# Altium schematic sheet Sensors.SchDoc
size A4
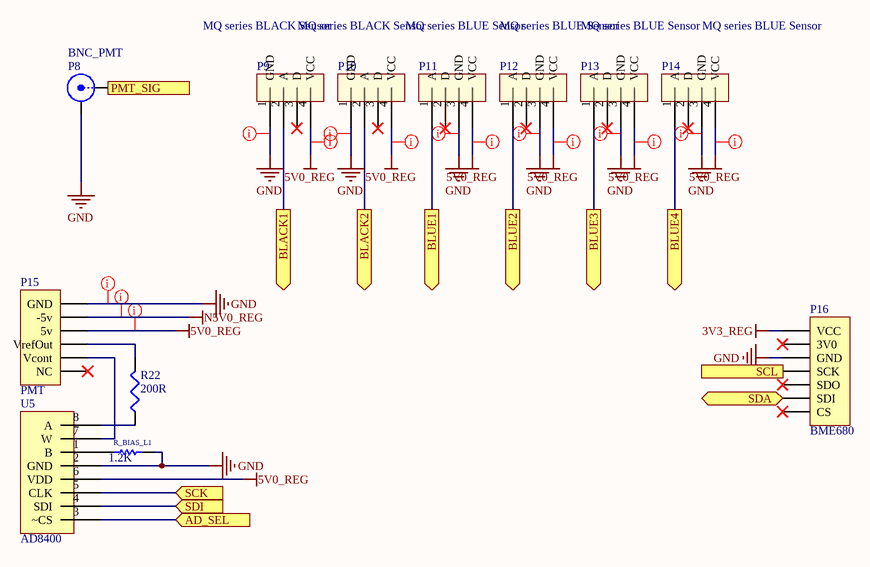
[diagram p0: Sensors.SchDoc]

## Parts
P8  BNC_PMT  [BNC_RA CON]
P9  MQ series BLACK Sensor  [MQ series BLACK sensor]
P10  MQ series BLACK Sensor  [MQ series BLACK sensor]
P11  MQ series BLUE Sensor  [MQ series BLUE sensor]
P12  MQ series BLUE Sensor  [MQ series BLUE sensor]
P13  MQ series BLUE Sensor  [MQ series BLUE sensor]
P14  MQ series BLUE Sensor  [MQ series BLUE sensor]
P15  PMT  [HDR1X6H]
P16  BME680  [HDR1X7]
R22  200R  [RESC1608X06N_0603]
R_BIAS_L1  1.2K  [RESC1608X06N_0603]
U5  AD8400  [AD8400(SOIC8)]

## Ports
AD_SEL (in), BLACK1 (out), BLACK2 (out), BLUE1 (out), BLUE2 (out), BLUE3 (out), BLUE4 (out), PMT_SIG (out), SCK (in), SCL (in), SDA (bidir), SDI (in)

## Nets
3V3_REG: P16.1(VCC)
5V0_REG: P9.4(VCC) P10.4(VCC) P11.4(VCC) P12.4(VCC) P13.4(VCC) P14.4(VCC) P15.6(5v) U5.6(VDD)
GND: P8.2(Y) P9.1(GND) P10.1(GND) P11.3(GND) P12.3(GND) P13.3(GND) P14.3(GND) P15.4(GND) P16.3(GND) R_BIAS_L1.2 U5.2(GND)
N5V0_REG: P15.5(-5v)
AD_SEL: U5.3(~CS) ; port AD_SEL
BLACK1: P9.2(A) ; port BLACK1
BLACK2: P10.2(A) ; port BLACK2
BLUE1: P11.1(A) ; port BLUE1
BLUE2: P12.1(A) ; port BLUE2
BLUE3: P13.1(A) ; port BLUE3
BLUE4: P14.1(A) ; port BLUE4
PMT_SIG: P8.1(X) ; port PMT_SIG
SCK: U5.5(CLK) ; port SCK
SCL: P16.4(SCK) ; port SCL
SDA: P16.6(SDI) ; port SDA
SDI: U5.4(SDI) ; port SDI
NetP15_2: P15.2(Vcont) U5.7(W)
NetP15_3: P15.3(VrefOut) R22.2
NetR22_1: R22.1 U5.8(A)
NetR_BIAS_L1_1: R_BIAS_L1.1 U5.1(B)

Not connected (* = marked no-connect by the designer): P9 3(D)*; P10 3(D)*; P11 2(D)*; P12 2(D)*; P13 2(D)*; P14 2(D)*; P15 1(NC)*; P16 2(3V0)* 5(SDO)* 7(CS)*

## Layout directives
rule Width Constraint [Pref Width = 15mil    Min Width = 15mil    Max Width = 15mil]: 5V0_REG, GND, N5V0_REG

## Library data of the parts
P8 = BNC: BNC Elbow Connector; LatestRevisionDate: 17-Jul-2002; LatestRevisionNote: Re-released for DXP Platform.; Publisher: Altium Limited
P15 = Header 6H: Header, 6-Pin, Right Angle; LatestRevisionDate: 17-Jul-2002; LatestRevisionNote: Re-released for DXP Platform.; Publisher: Altium Limited
P16 = Header 7: Header, 7-Pin; LatestRevisionDate: 17-Jul-2002; LatestRevisionNote: Re-released for DXP Platform.; Publisher: Altium Limited
R22 = RC1206FR-07200RL: RES SMD 200 OHM 1% 1/4W 1206; Manufacturer 1: Yageo; Temperature Coefficient: 100ppm/°C; Voltage Rating (DC): 200V; Power Rating: 250mW; Supplier 1: Digi-Key; Supplier Part Number 1: 311-200FRCT-ND; Manufacturer Part Number 1: RC1206FR-07200RL; Stock 1: 3032350; Pricing 1: 1=0,10000, 10=0,07100, 100=0,02910, 1000=0,01306, 2500=0,01134 (USD); RoHS: Yes; Mount: Surface Mount; Case/Package: 1206; Weight: 0.000571oz; Case Code (Imperial): 1206; Case Code (Metric): 3216; Min Operating Temperature: -55°C; Max Operating Temperature: 155°C; Tolerance: 1%; Resistance: 200R; Packaging: Tape and Reel; Composition: Thick Film; Voltage Rating: 200V; Termination: SMD/SMT; Military Standard: Not; Length: 3.1mm; Height: 0.55mm; Width: 1.6mm; Depth: 1.6mm; Lead Free: Lead Free; ComponentLink1URL: https://datasheet.ciiva.com/11808/0900766b80c6630a-11808603.pdf?src-supplier=RSComponents; ComponentLink1Description: https://datasheet.ciiva.com/11808/0900766b80c6630a-11808603.pdf?src-supplier=RSComponents; Category: Resistor
R_BIAS_L1 = Res1: Resistor; Published: 8-Jun-2000; LatestRevisionDate: 17-Jul-2002; LatestRevisionNote: Re-released for DXP Platform.; PackageReference: AXIAL-0.3; Publisher: Altium Limited; PackageDescription: Axial Device, Thru-Hole; 2 Leads; 0.3 in Pin Spacing
U5 = Component_1